# EAGLE design SensorFv (EAGLE 9.0.1)
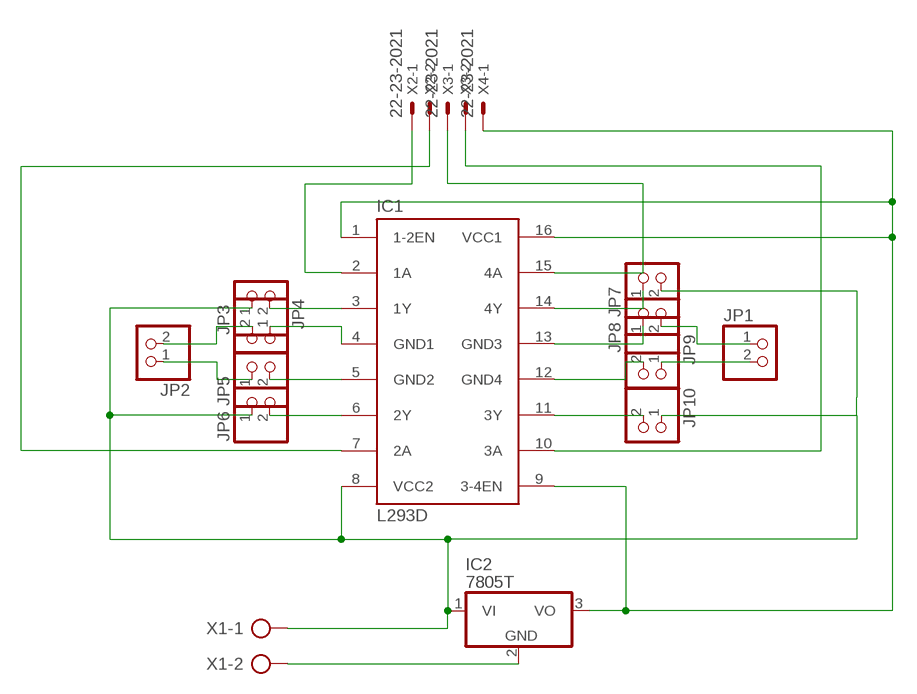
[diagram p0: schematic, sheet 1]

## Parts
IC1  L293D  [DIL16]
IC2  7805T  [TO220H]
JP1  PINHD-1X2  [1X02]
JP2  PINHD-1X2  [1X02]
JP3  PINHD-1X2  [1X02]
JP4  PINHD-1X2  [1X02]
JP5  PINHD-1X2  [1X02]
JP6  PINHD-1X2  [1X02]
JP7  PINHD-1X2  [1X02]
JP8  PINHD-1X2  [1X02]
JP9  PINHD-1X2  [1X02]
JP10  PINHD-1X2  [1X02]
X1  AK500/2-H  [AK500/2-H]
X2  22-23-2021  [22-23-2021]
X3  22-23-2021  [22-23-2021]
X4  22-23-2021  [22-23-2021]

## Nets
N$1: IC1.3(1Y) JP3.2
N$2: JP2.2 JP4.2
N$3: IC1.4(GND1) JP4.1
N$4: JP2.1 JP5.1
N$5: IC1.5(GND2) JP5.2
N$6: IC1.6(2Y) JP6.2
N$7: IC1.14(4Y) JP7.1
N$8: IC1.13(GND3) JP8.1
N$9: IC1.12(GND4) JP9.2
N$10: IC1.11(3Y) JP10.2
N$11: JP1.1 JP8.2
N$12: JP1.2 JP9.1
N$13: IC1.2(1A) X2.1
N$14: IC1.7(2A) X2.2
N$15: IC1.15(4A) X3.1
N$16: IC1.10(3A) X3.2
N$17: IC1.8(VCC2) IC2.1(VI) JP3.1 JP6.1 JP7.2 JP10.1 X1.1
N$19: IC1.1(1-2EN) IC1.9(3-4EN) IC1.16(VCC1) IC2.3(VO) X4.1
N$22: IC2.2(GND) X1.2
Unconnected: X4.2

## Library data of the parts
IC1 = st-microelectronics:L293D: PUSH-PULL 4 CHANNEL DRIVER; MPN: L293D; OC_FARNELL: 9589619; OC_NEWARK: 56P8249
IC2 = linear:78*: Positive VOLTAGE REGULATOR Source: http://cache.national.com/ds/LM/LM78L05.pdf http://www.fairchildsemi.com/ds/LM/LM7805.pdf
JP1-JP10 = pinhead:PINHD-1X2: PIN HEADER
X1 = con-ptr500:AK500/2-H: CONNECTOR Aug. 2004 / PTR Meßtechnik: Die Bezeichnung der Serie AK505 wurde geändert. Es handelt sich hierbei um AK500 in horizontaler Ausführung.; OC_FARNELL: unknown; OC_NEWARK: unknown
X2-X4 = con-molex:22-23-2021: .100" (2.54mm) Center Header - 2 Pin; MF: MOLEX; MPN: 22-23-2021; OC_FARNELL: 1462926; OC_NEWARK: 25C3832

## Board
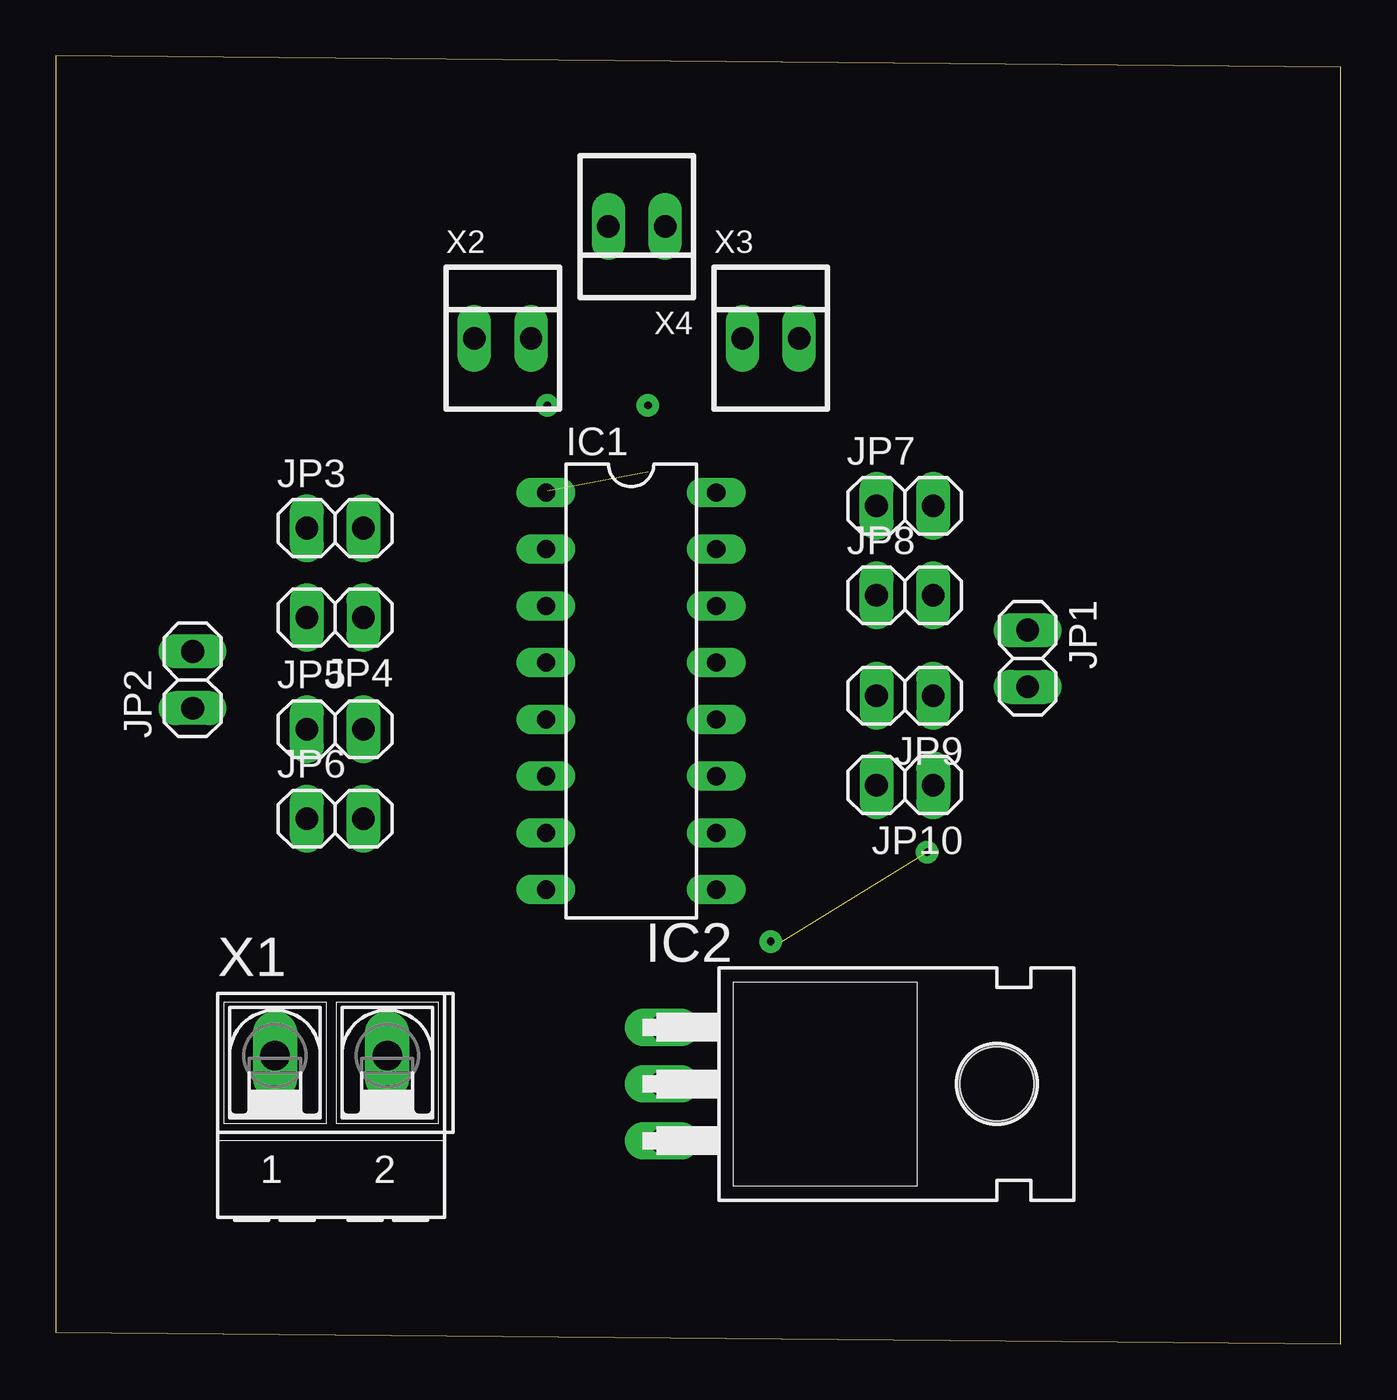
[diagram p1: board, top side]
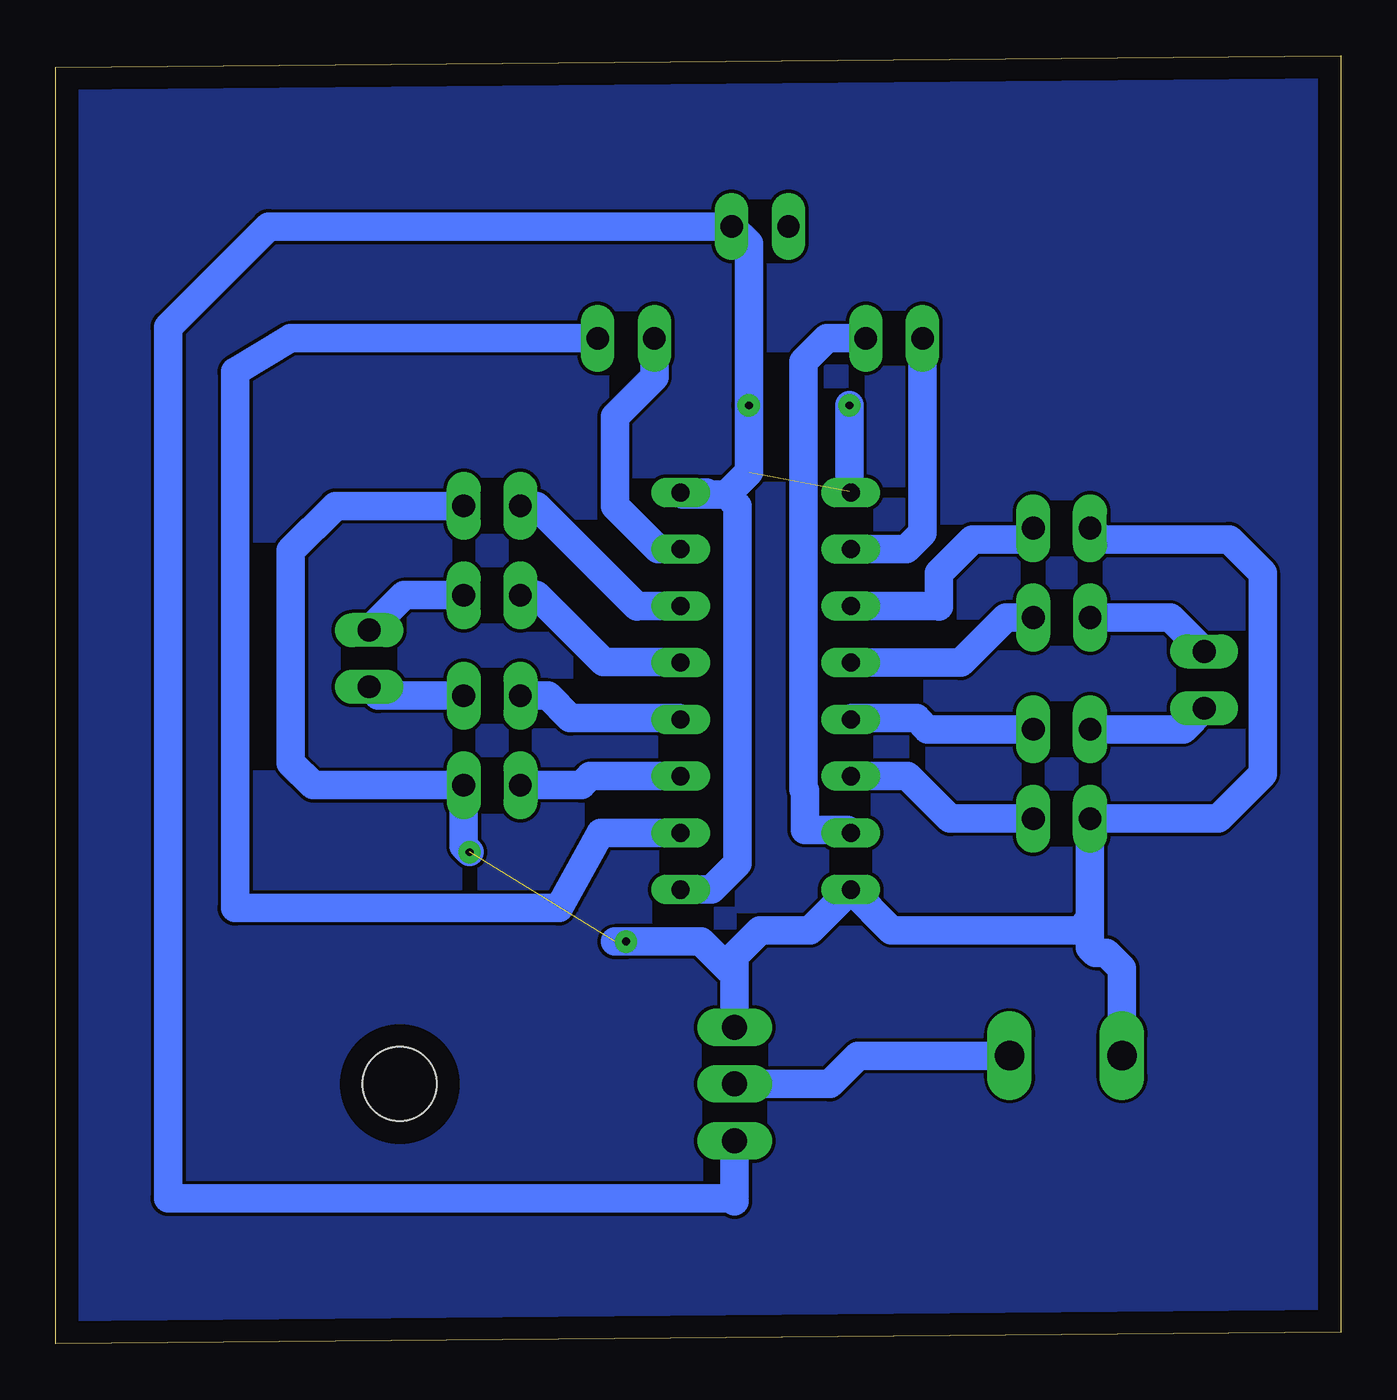
[diagram p2: board, bottom side, seen from below]

Size 57.52 x 57.64 mm. Coordinates in mm from the lower left corner, seen from the top.
Outline: 0,0.5 57.52,0 57.52,57.14 0,57.64 0,0.5
Copper layers (1*16): Top 0.035mm / dielectric 1.5mm / Bottom 0.035mm
Design rules "default": minimum track width 6mil, minimum drill 0.35mm, track to track 6mil, track to pad 6mil, pad to pad 6mil, via to via 6mil, smd to smd 6mil, copper to edge 40mil, drill to drill 6mil, minimum pad ring 10mil, minimum via ring 8mil, stop-mask expansion 4mil, vias tented up to drill 0mil, thermal gap 10mil

### Footprints (pad centres in the part's own frame; a part is rotated, then mirrored left to right if it is on the bottom)
DIL16 = drill 0.813 long: 1 -8.89,-3.81; 2 -6.35,-3.81; 3 -3.81,-3.81; 4 -1.27,-3.81; 5 1.27,-3.81; 6 3.81,-3.81; 7 6.35,-3.81; 8 8.89,-3.81; 9 8.89,3.81; 10 6.35,3.81; 11 3.81,3.81; 12 1.27,3.81; 13 -1.27,3.81; 14 -3.81,3.81; 15 -6.35,3.81; 16 -8.89,3.81
TO220H = drill 1.118 long: 1 -2.54,-10.16; 2 0,-10.16; 3 2.54,-10.16 | hole 3.302: 0,4.826
1X02 = drill 1.016 long: 1 -1.27,0; 2 1.27,0
AK500/2-H = drill 1.321 long: 1 -2.515,0; 2 2.515,0
22-23-2021 = drill 1 long: 1 -1.27,0; 2 1.27,0

### Placement (x,y rotation side)
IC1  25.75,29.21 270 top
IC2  37.3,11.62 270 top
JP1  43.5,30.67 270 top
JP2  6.12,29.71 90 top
JP3  12.5,36.5 0 top
JP4  12.5,32.5 180 top
JP5  12.5,27.5 0 top
JP6  12.5,23.5 0 top
JP7  38,37.5 0 top
JP8  38,33.5 0 top
JP9  38,29 180 top
JP10  38,25 180 top
X1  12.32,12.89 0 top
X2  20,45 0 top
X3  32,45 0 top
X4  26,50 180 top

### Tracks (layer width: path | path; a pad name or v marks a point on that pad's centre or on a via)
GND
  pour Bottom: 0,0.5 57.5,0 57.5,57 0,57.5 0,0.5 0.5,0.5
N$1
  Bottom 1.27: JP3.2 14.27,36 16.5,36 18,34.5 18,33 18.02,33.02 IC1.3
N$2
  Bottom 1.27: JP4.2 7.64,32.5 JP2.2
N$3
  Bottom 1.27: JP4.1 15,32.5 17.02,30.48 IC1.4
N$4
  Bottom 1.27: JP2.1 7.06,27.5 JP5.1
N$5
  Bottom 1.27: JP5.2 18.5,27.5 19,28 21.88,28 IC1.5
N$6
  Bottom 1.27: IC1.6 19.4,25.4 17.5,23.5 JP6.2
N$7
  Bottom 1.27: IC1.14 31.48,33.02 31.5,33 36,37.5 JP7.1
N$8
  Bottom 1.27: IC1.13 29.58,30.5 33,30.5 36,33.5 JP8.1
N$9
  Bottom 1.27: IC1.12 29.62,28 34.5,28 35.5,29 JP9.2
N$10
  Bottom 1.27: IC1.11 33.6,25.4 34,25 JP10.2
N$11
  Bottom 1.27: JP1.1 41.94,33.5 JP8.2
N$12
  Bottom 1.27: JP1.2 43.1,29 JP9.1
N$13
  Bottom 1.27: X2.1 18.73,36.27 19.44,35.56 IC1.2
N$14
  Bottom 1.27: X2.2 23,45 24.05,43.95 24.05,24.8 24,24.75 24,23 22.08,23 IC1.7
N$15
  Bottom 1.27: IC1.15 30.56,35.56 32.5,37.5 32.5,41.5 30.73,43.27 X3.1
N$16
  Bottom 1.27: X3.2 47,45 49.5,43.5 49.5,19.5 35,19.5 33.14,22.86 IC1.10
N$17  (via drill 0.35 pad 1)  (1 unrouted)
  Bottom 1.27: X1.1 9.8,16.8 10.5,17.5 11,17.5 11.23,17.73 11.23,19 | JP3.1 10.73,36 5,36 3.5,34.5 3.5,25.5 5.5,23.5 JP6.1 11.23,19 | 27.14,16.5 27.14,17.36 26,18.5 23.76,18.5 IC1.8 20.12,18.5 11.73,18.5 11.23,19 | 27.14,16.5 IC2.1 | JP7.2 45,37.5 47,35.5 47,26 46,25 JP10.1 39.27,22.27 v39,22 | 27.14,16.5 28.64,18 v32,18 32.5,18
N$19  (via drill 0.35 pad 1)  (1 unrouted)
  Bottom 1.27: X4.1 48,50 52.5,45.5 52.5,6.5 27.28,6.5 | 28.4,38.1 IC1.16 29.46,38 27.5,38 | 27,49.73 X4.1 | 27.28,6.5 27.14,6.36 | 27.5,38 27,37.5 27,21.5 28.18,20.32 IC1.9 | IC2.3 27.14,6.64 27.28,6.5 | IC1.1 22,38.16 v22,42 | X4.1 26.5,49.23 v26.5,42 26.5,39 27.5,38
N$22
  Bottom 1.27: X1.2 21.61,12.89 22.88,11.62 IC2.2